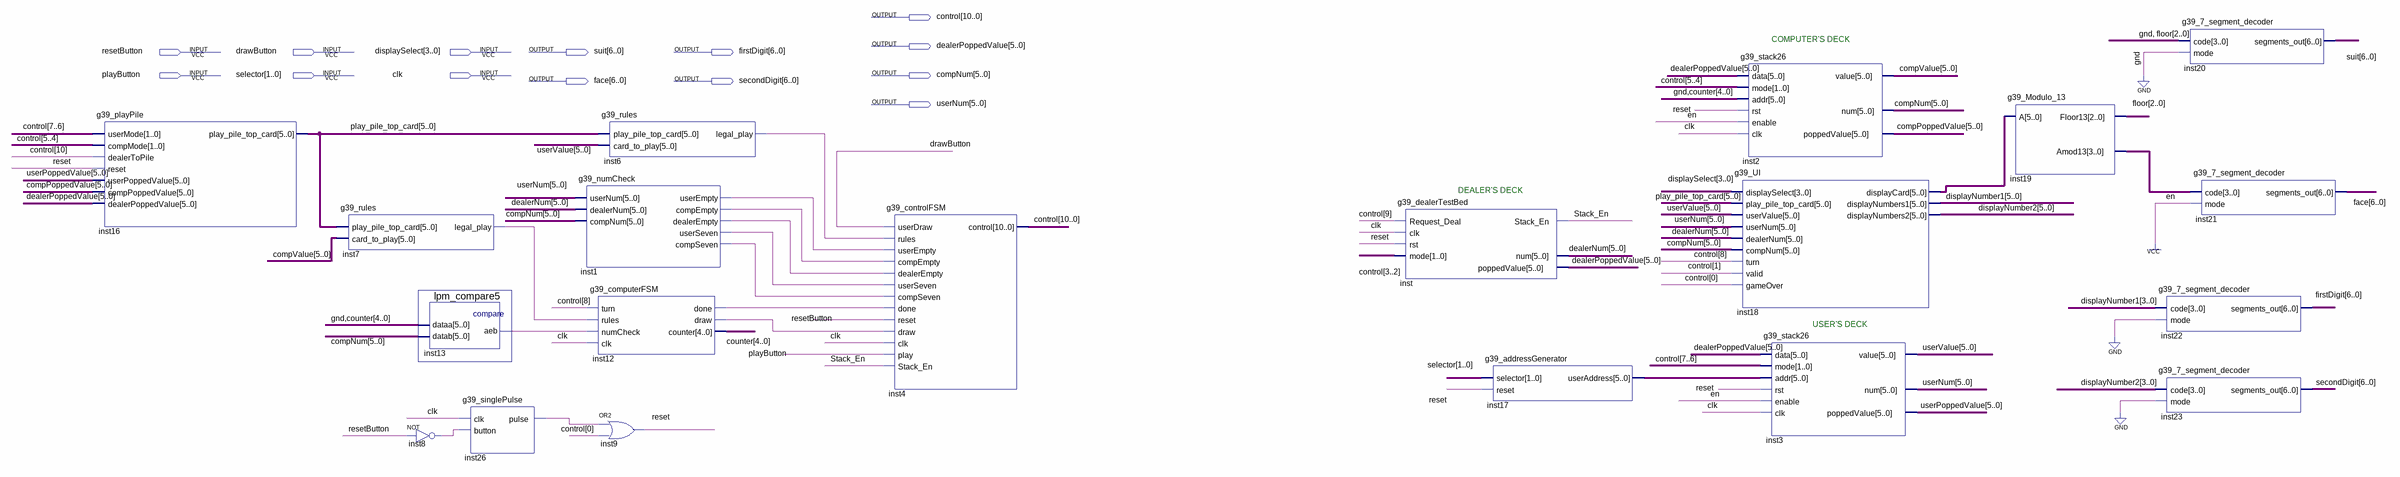
[diagram p0: schematic sheet]
// Quartus schematic g39_datapath.bdf as structural Verilog: 20 symbols, 14 pins
module g39_datapath (
  input  resetButton,
  input  drawButton,
  input  [3:0] displaySelect,
  input  playButton,
  input  [1:0] selector,
  input  clk,
  output [10:0] control,
  output [5:0] dealerPoppedValue,
  output [6:0] suit,
  output [6:0] firstDigit,
  output [5:0] compNum,
  output [6:0] face,
  output [6:0] secondDigit,
  output [5:0] userNum
);

  wire inst1_compempty, inst1_compseven, inst1_dealerempty, inst1_userempty, inst1_userseven,
       inst6_legal_play, inst7_legal_play, inst8_out, inst12_done, inst12_draw, inst13_aeb, inst26_pulse,
       reset, Stack_En;
  wire [2:0] floor;
  wire [3:0] inst19_amod13;
  wire [4:0] counter;
  wire [5:0] compPoppedValue, compValue, dealerNum, displayNumber1, displayNumber2, inst17_useraddress,
       inst18_displaycard, play_pile_top_card, userPoppedValue, userValue;

  g39_playPile inst16 (
    .userMode(control[7:6]), .compMode(control[5:4]), .dealerToPile(control[10]), .reset(reset),
    .userPoppedValue(userPoppedValue), .compPoppedValue(compPoppedValue),
    .dealerPoppedValue(dealerPoppedValue), .play_pile_top_card(play_pile_top_card));
  g39_rules inst7 (.play_pile_top_card(play_pile_top_card), .card_to_play(compValue), .legal_play(inst7_legal_play));
  lpm_compare5 inst13 (.dataa({1'b0, counter}), .datab(compNum), .aeb(inst13_aeb));
  not inst8 (inst8_out, resetButton);
  g39_singlePulse inst26 (.clk(clk), .button(inst8_out), .pulse(inst26_pulse));
  g39_rules inst6 (.play_pile_top_card(play_pile_top_card), .card_to_play(userValue), .legal_play(inst6_legal_play));
  g39_numCheck inst1 (
    .userNum(userNum), .dealerNum(dealerNum), .compNum(compNum), .userEmpty(inst1_userempty),
    .compEmpty(inst1_compempty), .dealerEmpty(inst1_dealerempty), .userSeven(inst1_userseven),
    .compSeven(inst1_compseven));
  g39_computerFSM inst12 (
    .turn(control[8]), .rules(inst7_legal_play), .numCheck(inst13_aeb), .clk(clk), .done(inst12_done),
    .draw(inst12_draw), .counter(counter));
  or inst9 (reset, inst26_pulse, control[0]);
  g39_controlFSM inst4 (
    .userDraw(drawButton), .rules(inst6_legal_play), .userEmpty(inst1_userempty),
    .compEmpty(inst1_compempty), .dealerEmpty(inst1_dealerempty), .userSeven(inst1_userseven),
    .compSeven(inst1_compseven), .done(inst12_done), .reset(resetButton), .draw(inst12_draw), .clk(clk),
    .play(playButton), .Stack_En(Stack_En), .control(control));
  g39_dealerTestBed inst (
    .Request_Deal(control[9]), .clk(clk), .rst(reset), .mode(control[3:2]), .Stack_En(Stack_En),
    .num(dealerNum), .poppedValue(dealerPoppedValue));
  g39_addressGenerator inst17 (.selector(selector), .reset(reset), .userAddress(inst17_useraddress));
  g39_UI inst18 (
    .displaySelect(displaySelect), .play_pile_top_card(play_pile_top_card), .userValue(userValue),
    .userNum(userNum), .dealerNum(dealerNum), .compNum(compNum), .turn(control[8]), .valid(control[1]),
    .gameOver(control[0]), .displayCard(inst18_displaycard), .displayNumbers1(displayNumber1),
    .displayNumbers2(displayNumber2));
  g39_stack26 inst2 (
    .addr({1'b0, counter}), .clk(clk), .data(dealerPoppedValue), .enable(1'b1), .mode(control[5:4]),
    .rst(reset), .num(compNum), .poppedValue(compPoppedValue), .value(compValue));
  g39_stack26 inst3 (
    .addr(inst17_useraddress), .clk(clk), .data(dealerPoppedValue), .enable(1'b1), .mode(control[7:6]),
    .rst(reset), .num(userNum), .poppedValue(userPoppedValue), .value(userValue));
  g39_Modulo_13 inst19 (.A(inst18_displaycard), .Amod13(inst19_amod13), .Floor13(floor));
  g39_7_segment_decoder inst20 (.code({1'b0, floor}), .mode(1'b0), .segments_out(suit));
  g39_7_segment_decoder inst21 (.code(inst19_amod13), .mode(1'b1), .segments_out(face));
  g39_7_segment_decoder inst22 (.code(displayNumber1[3:0]), .mode(1'b0), .segments_out(firstDigit));
  g39_7_segment_decoder inst23 (.code(displayNumber2[3:0]), .mode(1'b0), .segments_out(secondDigit));

  // Notes on the sheet:
  //   COMPUTER'S DECK
  //   DEALER'S DECK
  //   USER'S DECK
endmodule
